# EAGLE design a_civil_hero_vermin_orderv (EAGLE 9.6.2)
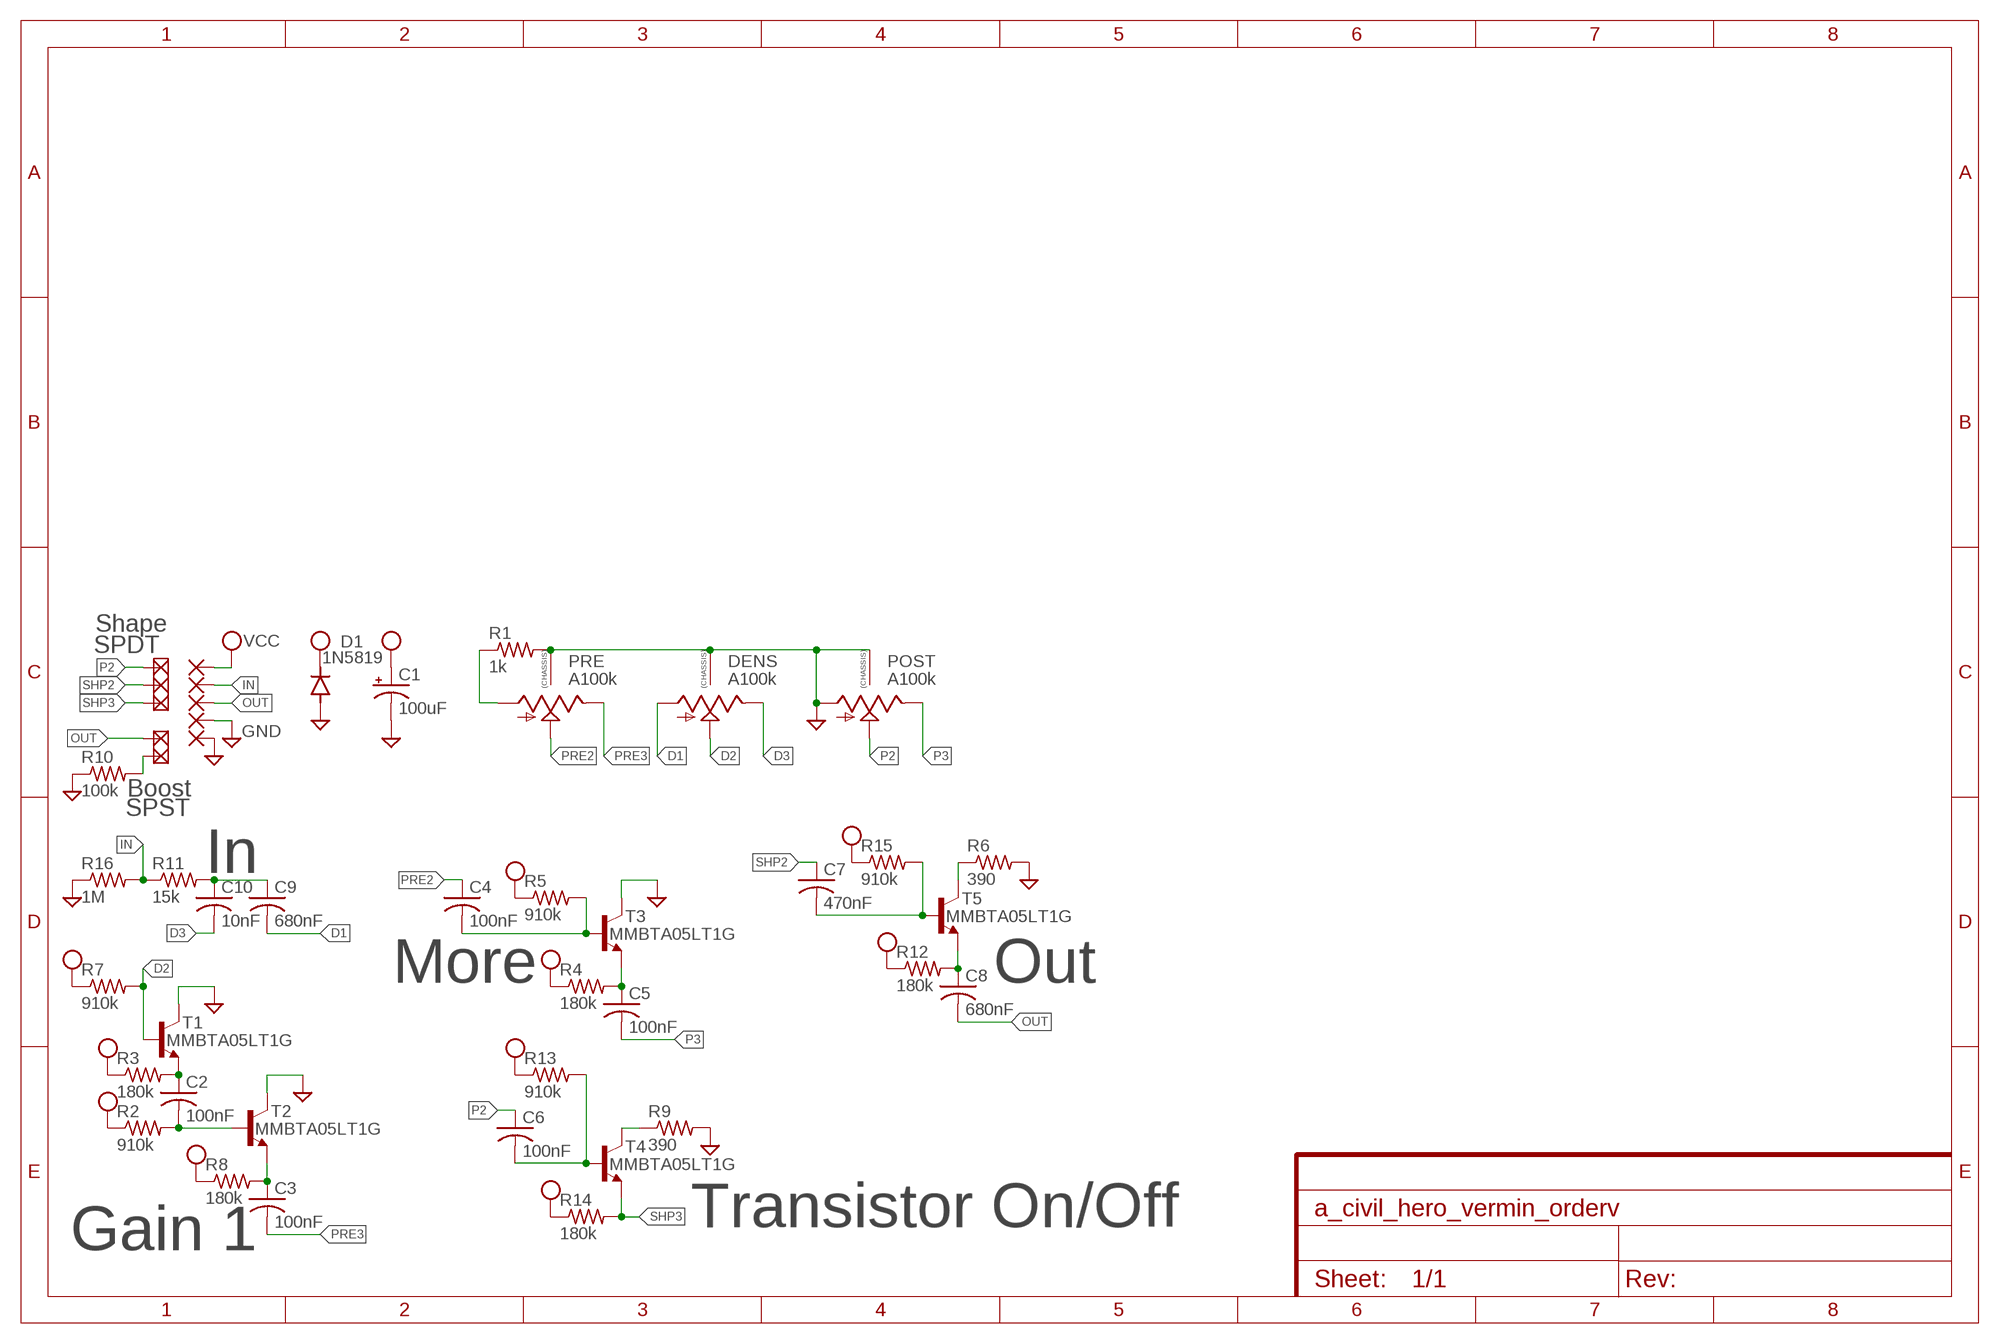
[diagram p0: schematic, sheet 1]

## Parts
BOOST  1,6/0,8  [1,6/0,8]
C1  100uF  100UF-POLAR-RADIAL-2.5MM-25V-20%  [CPOL-RADIAL-2.5MM-6.5MM]
C2  100nF  C-USC0603  [C0603]
C3  100nF  C-USC0603  [C0603]
C4  100nF  C-USC0603  [C0603]
C5  100nF  C-USC0603  [C0603]
C6  100nF  C-USC0603  [C0603]
C7  470nF  C-USC0603  [C0603]
C8  680nF  C-USC0603  [C0603]
C9  680nF  C-USC0603  [C0603]
C10  10nF  C-USC0603  [C0603]
D1  1N5819  DIODE-SOD123  [SOD123]
DENS  A100k  9MM_SNAP-IN_POT_CHASSIS  [9MM_SNAP-IN_POT]
PAD1  1,6/0,8  [1,6/0,8]
PAD2  1,6/0,8  [1,6/0,8]
PAD3  1,6/0,8  [1,6/0,8]
PAD4  1,6/0,8  [1,6/0,8]
PAD5  1,6/0,8  [1,6/0,8]
PAD7  1,6/0,8  [1,6/0,8]
POST  A100k  9MM_SNAP-IN_POT_CHASSIS  [9MM_SNAP-IN_POT]
PRE  A100k  9MM_SNAP-IN_POT_CHASSIS  [9MM_SNAP-IN_POT]
R1  1k  R-US_R0603  [R0603]
R2  910k  R-US_R0603  [R0603]
R3  180k  R-US_R0603  [R0603]
R4  180k  R-US_R0603  [R0603]
R5  910k  R-US_R0603  [R0603]
R6  390  R-US_R0603  [R0603]
R7  910k  R-US_R0603  [R0603]
R8  180k  R-US_R0603  [R0603]
R9  390  R-US_R0603  [R0603]
R10  100k  R-US_R0603  [R0603]
R11  15k  R-US_R0603  [R0603]
R12  180k  R-US_R0603  [R0603]
R13  910k  R-US_R0603  [R0603]
R14  180k  R-US_R0603  [R0603]
R15  910k  R-US_R0603  [R0603]
R16  1M  R-US_R0603  [R0603]
SHAPE1  1,6/0,8  [1,6/0,8]
SHAPE2  1,6/0,8  [1,6/0,8]
SHAPE3  1,6/0,8  [1,6/0,8]
T1  MMBTA05LT1G  MMBTA42LT1-NPN-SOT23-BEC  [SOT23-BEC]
T2  MMBTA05LT1G  MMBTA42LT1-NPN-SOT23-BEC  [SOT23-BEC]
T3  MMBTA05LT1G  MMBTA42LT1-NPN-SOT23-BEC  [SOT23-BEC]
T4  MMBTA05LT1G  MMBTA42LT1-NPN-SOT23-BEC  [SOT23-BEC]
T5  MMBTA05LT1G  MMBTA42LT1-NPN-SOT23-BEC  [SOT23-BEC]

## Nets
BOOST1: BOOST.1(P) R10.2
D1: C9.2 DENS.1(A)
D2: DENS.2(S) R7.2 T1.B
D3: C10.2 DENS.3(E)
GND: C1.2(-) D1.A DENS.CHASSIS1 DENS.CHASSIS2 PAD4.1(P) PAD7.1(P) POST.1(A) POST.CHASSIS1 POST.CHASSIS2 PRE.CHASSIS1 PRE.CHASSIS2 R1.2 R6.2 R9.2 R10.1 R16.1 T1.C T2.C T3.C
IN: PAD2.1(P) R11.1 R16.2
N$2: C3.1 R8.2 T2.E
N$3: PRE.1(A) R1.1
N$4: C9.1 C10.1 R11.2
N$5: C2.1 R3.2 T1.E
N$6: C2.2 R2.2 T2.B
N$7: C4.2 R5.2 T3.B
N$8: C5.1 R4.2 T3.E
N$9: R9.1 T4.C
N$10: C6.2 R13.2 T4.B
N$11: C7.2 R15.2 T5.B
N$12: R6.1 T5.C
N$13: C8.1 R12.2 T5.E
OUT: C8.2 PAD3.1(P) PAD5.1(P)
P2: C6.1 POST.2(S) SHAPE1.1(P)
P3: C5.2 POST.3(E)
PRE2: C4.1 PRE.2(S)
PRE3: C3.2 PRE.3(E)
SHP2: C7.1 SHAPE2.1(P)
SHP3: R14.2 SHAPE3.1(P) T4.E
VCC: C1.1(+) D1.C PAD1.1(P) R2.1 R3.1 R4.1 R5.1 R7.1 R8.1 R12.1 R13.1 R14.1 R15.1

## Notes on the sheet
- Shape
- SPDT
- Boost
- SPST
- In
- More | Out
- Transistor On/Off
- Gain 1

## Library data of the parts
BOOST PAD1-PAD5 PAD7 SHAPE1-SHAPE3 = wirepad:1,6/0,8: THROUGH-HOLE PAD
C1 = SparkFun-Capacitors:100UF-POLAR: 100µF polarized capacitors A capacitor is a passive two-terminal electrical component used to store electrical energy temporarily in an electric field.; PROD_ID: CAP-08439
C2-C10 = adafruit:C-US: CAPACITOR, American symbol
D1 = diode:DIODE-: DIODE
DENS POST PRE = MusicThingModular:9MM_SNAP-IN_POT_CHASSIS: 9mm vertical snap-in pot, Alpha / Panasonic style, with a connection to the metal chassis for grounding
R1-R16 = adafruit:R-US_: RESISTOR, American symbol
T1-T5 = MusicThingModular:*-NPN-: NPN Transistror BF959 corrected 2008.03.06

## Board
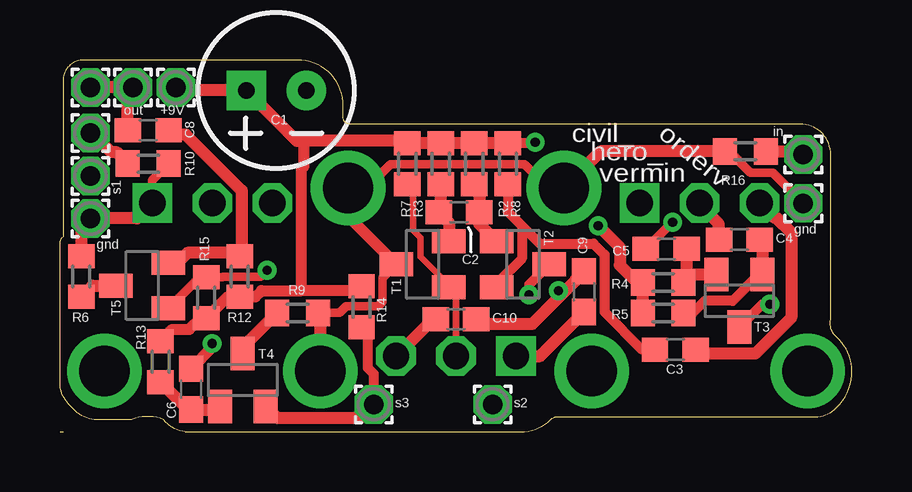
[diagram p1: board, top side]
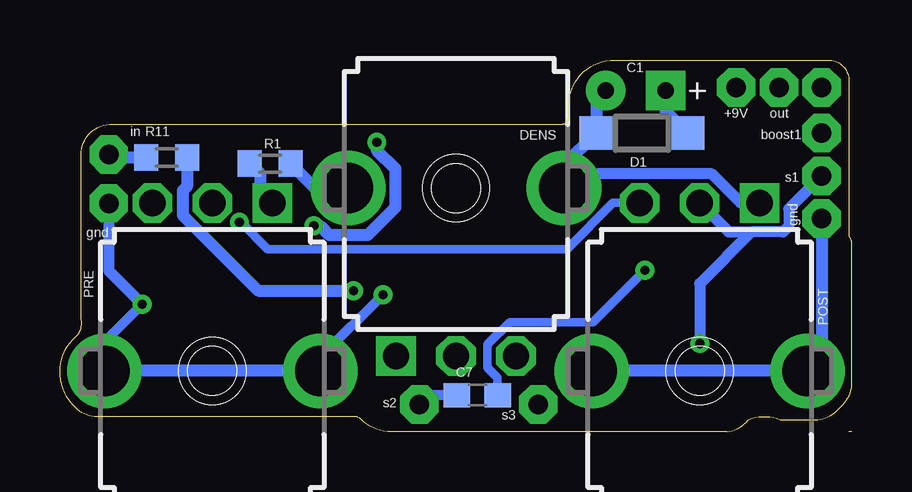
[diagram p2: board, bottom side, seen from below]

Size 33.02 x 15.49 mm. Coordinates in mm from the lower left corner, seen from the top.
Outline: 0,0 0.13,0
Outline: 5.22,0 19.22,0 arc45 20.45,0.51 arc-45 20.75,0.64 31.5,0.64 arc45 32.36,0.99 32.39,1.02 arc45 33.02,2.54 arc45 32.48,3.84 32.26,4.06 arc-45 32.13,4.68 32.13,11.56 arc90 30.86,12.83 12.06,12.83 arc-90 11.81,13.08 11.81,13.59 arc90 9.91,15.49 0.99,15.49 arc45 0.38,15.24 arc45 0.13,14.63 0.13,8.13 arc45 0,7.82 0,2.05 arc45 0.37,1.15 0.64,0.88 arc45 1.54,0.51 3,0.51 arc-45 4.32,0.51 4.33,0.5 arc45 5.22,0
Copper layers (1*16): Top 0.035mm / dielectric 1.5mm / Bottom 0.035mm
Design rules "default *": minimum track width 6mil, minimum drill 0.35mm, track to track 6mil, track to pad 6mil, pad to pad 6mil, via to via 6mil, smd to smd 6mil, copper to edge 10mil, drill to drill 6mil, minimum pad ring 10mil, minimum via ring 8mil, stop-mask expansion 4mil, vias tented up to drill 0mil, thermal gap 10mil

### Footprints (pad centres in the part's own frame; a part is rotated, then mirrored left to right if it is on the bottom)
1,6/0,8 = drill 0.813 pad 1.6 octagon: 1 0,0
CPOL-RADIAL-2.5MM-6.5MM = drill 0.7 pad 1.651 square: 1 1.25,0 | drill 0.7 pad 1.651: 2 -1.25,0
C0603 = smd 1.1 x 1: 1 -0.85,0; 2 0.85,0
SOD123 = smd 1.4 x 1.4: A 1.9,0; C -1.9,0
9MM_SNAP-IN_POT = drill 1.1 square: 1 -2.5,-7 | drill 1.1 octagon: 2 0,-7; 3 2.5,-7 | drill 2.1 pad 2.794: CHASSIS1 -4.5,0; CHASSIS2 4.5,0
R0603 = smd 1 x 1.1: 1 -0.85,0; 2 0.85,0
SOT23-BEC = smd 1 x 1.4: B -0.95,-1.1; C 0,1.1; E 0.95,-1.1

### Placement (x,y rotation side)
BOOST  1.27,12.45 0 top
C1  9.02,14.22 180 top
C2  16.64,9.14 0 top
C3  25.65,3.43 0 top
C4  28.32,8 0 top
C5  25.27,7.62 180 top
C6  5.46,1.78 270 top
C7  15.62,1.52 0 bottom
C8  3.68,12.57 180 top
C9  21.84,5.84 270 top
C10  16.51,4.7 180 top
D1  8.76,12.45 180 bottom
DENS  16.51,10.16 0 bottom
PAD1  4.83,14.35 0 top
PAD2  30.99,11.56 0 top
PAD3  3.05,14.35 0 top
PAD4  1.27,8.89 0 top
PAD5  1.27,14.35 0 top
PAD7  30.99,9.53 0 top
POST  6.35,2.54 180 bottom
PRE  26.67,2.54 180 bottom
R1  24.26,11.18 0 bottom
R2  17.27,11.18 270 top
R3  15.88,11.18 270 top
R4  25.15,6.22 0 top
R5  25.15,4.95 0 top
R6  0.89,6.48 90 top
R7  14.48,11.18 270 top
R8  18.67,11.18 270 top
R9  9.91,4.95 0 top
R10  3.68,11.18 180 top
R11  28.57,11.43 0 bottom
R12  7.49,6.48 90 top
R13  4.19,2.92 270 top
R14  12.57,5.21 270 top
R15  6.1,5.59 90 top
R16  28.57,11.68 0 top
SHAPE1  1.27,10.67 0 top
SHAPE2  18.03,1.14 0 top
SHAPE3  13.08,1.14 0 top
T1  15.11,6.99 90 top
T2  19.3,6.99 270 top
T3  28.32,5.46 180 top
T4  7.62,2.16 0 top
T5  3.43,6.1 90 top

### Tracks (layer width: path | path; a pad name or v marks a point on that pad's centre or on a via)
BOOST1
  Top 0.508: R10.2 2.34,11.67 2.12,11.67 1.33,12.45 BOOST.1
D1
  Top 0.508: 21.36,4.5 | 21.36,4.5 C9.2 | DENS.1 20.01,3.16 21.36,4.5
D2
  Top 0.279: R7.2 14.71,10.09 14.71,8.41 15.03,8.09 15.03,7.29 16.21,6.11 | DENS.2 16.51,5.74 T1.B
  Top 0.406: T1.B 16.21,6.11
D3
  Top 0.508: DENS.3 15.55,4.7 C10.2
GND  (via drill 0.38)
  Top 0.356: POST.1 3.85,10.49 R10.1 | PAD7.1 29.71,10.8 28.79,10.8 27.91,11.68 R16.1 | T1.C 13.45,6.42 13.45,5.42 13.26,5.23 11.93,5.23 11.65,4.95 R9.2 | DENS.CHASSIS2 12.79,10.16 13.79,11.16 19.36,11.16 20.35,10.16 DENS.CHASSIS1
  Top 0.406: T3.C 29.27,5.32 v29.59,5.32 | T2.C 19.56,6.14 v19.56,5.71
  Top 0.457: T1.C 12.01,8.99 DENS.CHASSIS2
  Top 0.508: POST.1 3.2,8.89 PAD4.1 0.89,8.51 R6.2 | R9.2 10.85,4.86 POST.CHASSIS2 | R16.1 22.53,11.68 DENS.CHASSIS1
  Bottom 0.406: v29.59,5.32 31.17,3.74 PRE.CHASSIS2 | v19.56,5.71 22.17,3.1 PRE.CHASSIS1
  Bottom 0.457: POST.1 4.64,9.54 5.85,10.75 10.62,10.75 11.21,10.16 DENS.CHASSIS2 | PAD7.1 30.99,6.71 v29.59,5.32
  Bottom 0.508: PAD4.1 1.27,3.12 POST.CHASSIS1 POST.CHASSIS2 | C1.2 10.66,13.83 D1.A 12.01,11.1 DENS.CHASSIS2 | R1.2 22.39,10.16 DENS.CHASSIS1 | PRE.CHASSIS1 PRE.CHASSIS2
IN
  Top 0.508: R16.2 30.86,11.68 PAD2.1
  Bottom 0.508: R11.1 30.86,11.43 PAD2.1
N$2
  Top 0.406: R8.2 18.67,9.17 19.26,8.58 | 19.26,8.58 19.26,7.22 18.2,6.16 T2.E | 19.26,8.58 20,7.84 22.25,7.84 22.7,7.39 22.7,5 24.27,3.43 C3.1
N$3
  Bottom 0.508: PRE.1 24.68,10.05 24.68,10.75 R1.1
N$4  (via drill 0.38)
  Top 0.508: C10.1 17.57,4.49 19.69,4.49 21.08,5.88 | C9.1 21.51,6.36 21.51,6.32 21.08,5.88 | 21.08,5.88 v20.79,5.88
  Bottom 0.508: R11.2 27.73,10.23 27.9,10.05 27.9,9.03 24.75,5.88 v20.79,5.88
N$5
  Top 0.508: T1.E 16.21,8.72 C2.1 15.88,9.23 R3.2
N$6
  Top 0.508: T2.B 17.49,8.65 C2.2 17.49,9.88 17.33,10.04 17.33,10.27 R2.2
N$7
  Top 0.406: R5.2 26.38,4.95 26.89,5.46 28.04,5.46 29.14,6.56 T3.B
  Top 0.508: C4.2 29.27,7.9 T3.B
N$8
  Top 0.508: C5.1 26.12,6.35 R4.2 26.33,6.56 T3.E
N$9
  Top 0.508: T4.C 7.62,3.52 R9.1
N$10
  Top 0.508: R13.2 5.33,0.93 C6.2 6.54,0.93 T4.B
N$11  (via drill 0.38)
  Top 0.356: T5.B 5.82,6.44 | R15.2 6.79,6.44 6.81,6.46 8.36,6.46 v8.64,6.73
  Top 0.508: 5.82,6.44 R15.2
  Bottom 0.356: C7.2 14.77,2.25 15.19,2.67 15.19,3.65 14.27,4.57 10.79,4.57 v8.64,6.73
N$12
  Top 0.508: R6.1 1.36,6.1 T5.C
N$13
  Top 0.508: C8.1 4.72,12.39 5.25,12.39 7.58,10.05 7.58,7.42 R12.2 7.37,7.45 5.32,7.45 4.91,7.05 T5.E
OUT
  Top 0.508: C8.2 2.83,14.14 PAD3.1 PAD5.1
P2  (via drill 0.38)
  Top 0.457: v6.35,3.68 6.35,3.52 C6.1
  Bottom 0.457: SHAPE1.1 2.64,9.29 2.64,8.56 2.87,8.33 4.19,8.33 | 4.19,8.33 6.35,6.17 v6.35,3.68 | POST.2 5.14,8.33 4.19,8.33
P3  (via drill 0.38)
  Top 0.356: v25.54,8.73 v25.53,8.73 C5.2
  Bottom 0.356: POST.3 9.96,9.54 11.89,7.61 24.36,7.61 25.48,8.73 v25.54,8.73
PRE2
  Top 0.508: C4.1 27.46,8.01 27.46,8.67 26.67,9.46 PRE.2
PRE3
  Top 0.508: PRE.3 29.8,8.91 29.89,8.91 30.48,8.32 30.48,4.75 28.99,3.25 26.68,3.25 C3.2
SHP2
  Bottom 0.406: C7.1 17.65,1.52 SHAPE2.1
SHP3
  Top 0.406: SHAPE3.1 13.08,2.42 12.83,2.67 12.83,4.1 R14.2
  Top 0.508: T4.E 9.05,0.58 12.51,0.58 SHAPE3.1
VCC  (via drill 0.38)
  Top 0.406: v19.81,12.06 19.77,12.03 R8.1 | 12.38,5.86 R14.1
  Top 0.457: 10.16,12.12 10.16,11.05 10.07,10.96 10.07,5.88 | R13.1 4.68,4.26 5.39,4.26 5.86,4.74 R15.1 6.99,5.63 R12.1 8.14,5.63 8.4,5.88 10.07,5.88 | R14.1 12.4,5.88 10.07,5.88
  Top 0.508: R8.1 R2.1 R3.1 R7.1 14.38,12.12 10.16,12.12 9.87,12.12 C1.1 4.95,14.22 PAD1.1 | R5.1 R4.1 24.07,6.22 23.34,6.95 23.34,7.68 v22.44,8.58
  Bottom 0.508: D1.C 7.77,13.35 C1.1 | v19.81,12.06 19.81,11.74 19.05,10.97 19.05,9.35 20.2,8.2 21.8,8.2 22.18,8.58 v22.44,8.58

### Text on the board
tPlace: out | +9V | civil_ | orderv | in | hero_ | s1 | vermin | gnd | gnd | s3 | s2
bPlace: C1 | + | out | +9V | boost1 | in | gnd | s1 | gnd | s3 | s2